# EAGLE design eCog110_Buzzer (EAGLE 6.6.0)
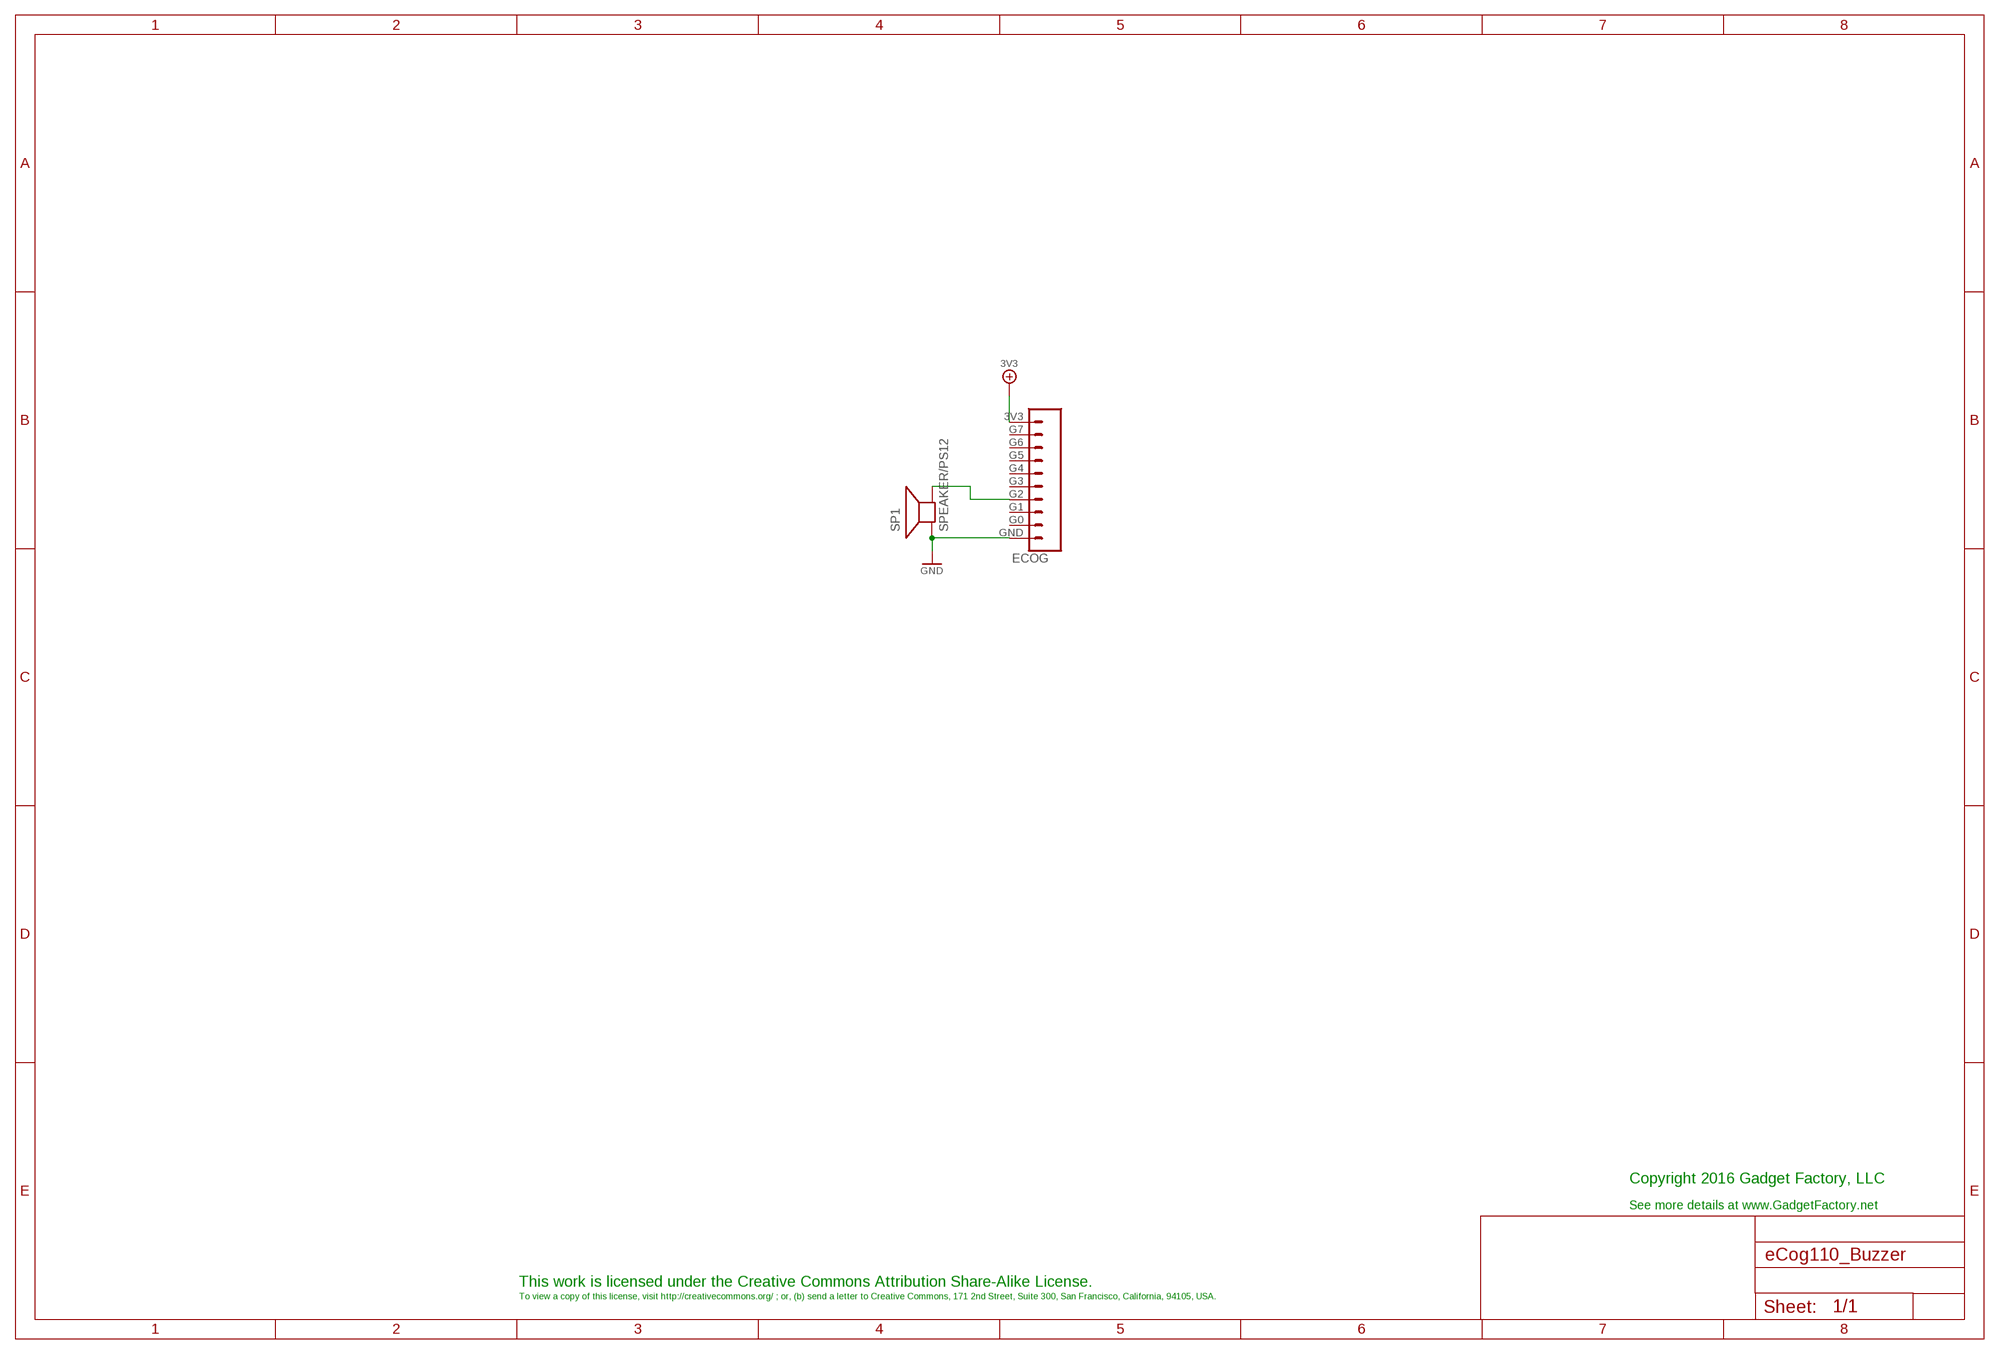
[diagram p0: schematic, sheet 1]

## Parts
ECOG  ECOG_GENERAL_ROWECOG_GENERAL_SMD  [ECOG_GENERAL_SMD]
SP1  SPEAKER/PS12  [PS12]

## Nets
3V3: ECOG.3V3
GND: ECOG.GND SP1.P$1(+)
N$1: ECOG.G2 SP1.P$2(-)
Unconnected: ECOG.G0 ECOG.G1 ECOG.G3 ECOG.G4 ECOG.G5 ECOG.G6 ECOG.G7

## Notes on the sheet
- Copyright 2016 Gadget Factory, LLC
- See more details at www.GadgetFactory.net
- This work is licensed under the Creative Commons Attribution Share-Alike License.
- To view a copy of this license, visit http://creativecommons.org/ ; or, (b) send a letter to Creative Commons, 171 2nd Street, Suite 300, San Francisco, California, 94105, USA.

## Library data of the parts
ECOG = eCogs:ECOG_GENERAL_ROW; DIGIKEY: S1013EC-10-ND; PARTNO: NREC010SABC-M30RC,SULLINS CONNECTOR SOLUTIONS,dk,S1013EC-10-ND,"10 Positions Header, Unshrouded Connector 0.100"" (2.54mm) Surface Mount Tin eCog", REF78
SP1 = adafruit:SPEAKER: SPEAKER Source: Buerklin Added PS12 (for part # PS1240 piezo) http://www.ladyada.net/library/pcb/eaglelibrary.html; DIGIKEY: 445-2525-1-ND; PARTNO: PS1240P02BT,TDK CORPORATION (VA),dk,445-2525-1-ND,"Zero-Peak Signal Buzzer Single Tone 4kHz Piezo 30V (Max) 60dB @ 3V, 10cm ", REF77

## Board
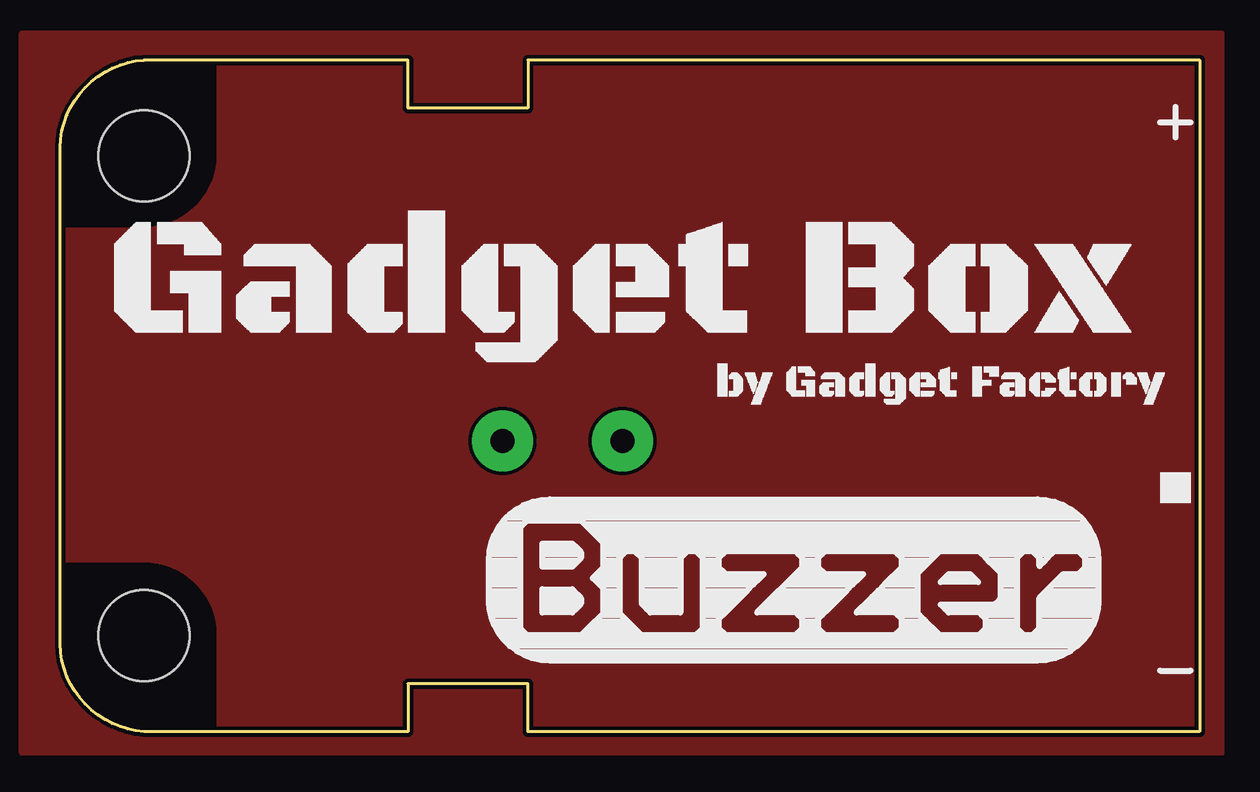
[diagram p1: board, top side]
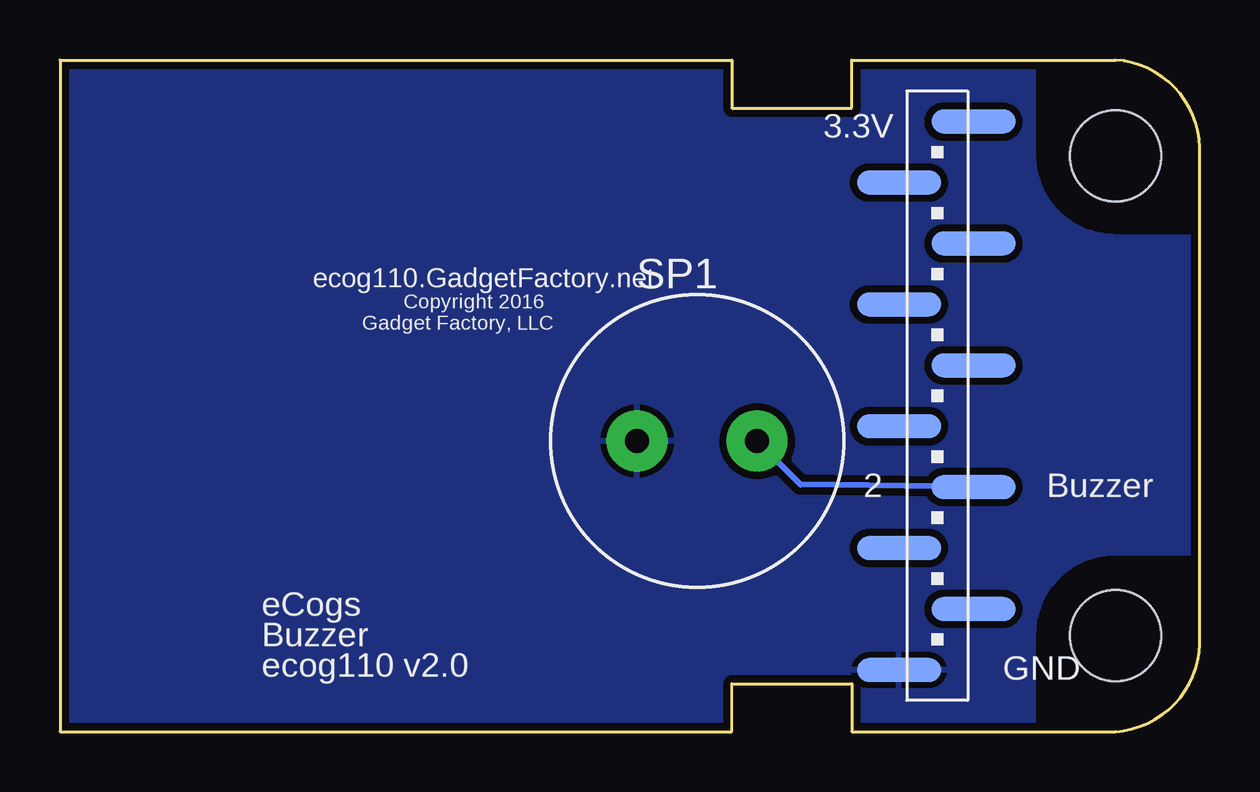
[diagram p2: board, bottom side, seen from below]

Size 47.51 x 28 mm. Coordinates in mm from the lower left corner, seen from the top.
Copper layers (1*16): Top 0.035mm / dielectric 1.5mm / Bottom 0.035mm
Design rules "hackvana *": minimum track width 6mil, minimum drill 0.3mm, track to track 6mil, track to pad 6mil, pad to pad 6mil, via to via 6mil, smd to smd 0mil, copper to edge 6mil, drill to drill 6mil, minimum pad ring 10mil, minimum via ring 6mil, stop-mask expansion 2mil, vias tented up to drill 100mil, thermal gap 10mil

### Footprints (pad centres in the part's own frame; a part is rotated, then mirrored left to right if it is on the bottom)
ECOG_GENERAL_SMD = smd 3.5 x 1 bottom: 3V3 9.923,25.429; G0 9.923,5.111; G1 13.022,7.649; G2 9.923,10.189; G3 13.022,12.729; G4 9.923,15.269; G5 13.022,17.809; G6 9.923,20.349; G7 13.022,22.889; GND 13.022,2.571 | hole 3.8: 4,24; 4,4
PS12 = drill 1 pad 2.54: P$1 -2.5,0; P$2 2.5,0

### Placement (x,y rotation side)
ECOG  -0.49,0 0 top
SP1  20.95,12.11 0 bottom
U$1  [GADGETBOX_TEXT]  23.54,18.35 0 top
U$4  [LEGEND_PWM]  46.5,10.16 0 top

### Tracks (layer width: path | path; a pad name or v marks a point on that pad's centre or on a via)
3V3
  pour Top: -1.59,29.11 48.41,29.11 48.41,-0.89 -1.59,-0.89
GND
  pour Bottom (isolate 0.305): -2.59,30.11 49.41,30.11 49.41,-1.89 -2.59,-1.89
N$1
  Bottom 0.254: ECOG.G2 16.64,10.3 SP1.P$2

### Text on the board
bPlace: 3.3V | ecog110.GadgetFactory.net | Copyright 2016 | Gadget Factory, LLC | Buzzer | 2 | eCogs | Buzzer | GND | ecog110 v2.0